# Altium schematic sheet YK.SchDoc
size A3
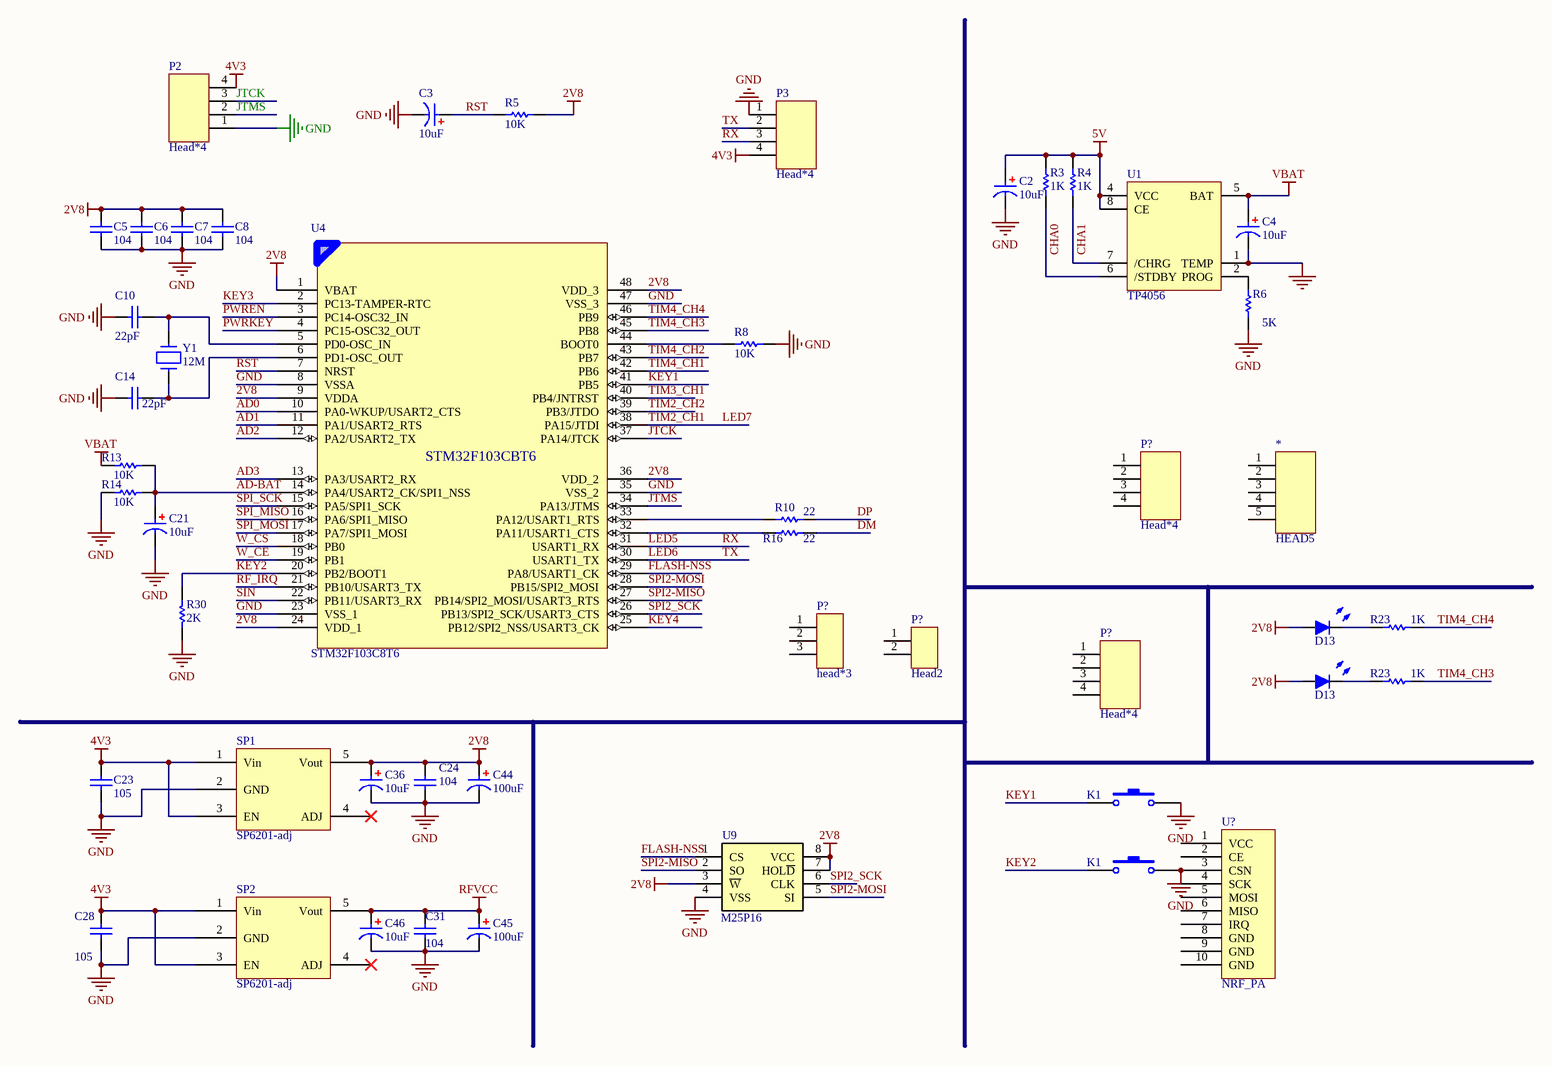
[diagram p0: YK.SchDoc]

## Parts
(Parts that share a designator on the sheet are numbered #1, #2 ... from top to bottom, then left to right.)
*  HEAD5
C2  C10uF  [0805-INC]  (value not drawn)
C3  C10uF  [0805-INC]  (value not drawn)
C4  C10uF  [0805-INC]  (value not drawn)
C5  C0.1uF  [0603C]  (value not drawn)
C6  C0.1uF  [0603C]  (value not drawn)
C7  C0.1uF  [0603C]  (value not drawn)
C8  C0.1uF  [0603C]  (value not drawn)
C10  C22pF  [0603R]  (value not drawn)
C14  C22pF  [0603R]  (value not drawn)
C21  C10uF  [0805-INC]  (value not drawn)
C23  C1uF  [0603C]  (value not drawn)
C24  C0.1uF  [0603C]  (value not drawn)
C28  C1uF  [0603C]  (value not drawn)
C31  C0.1uF  [0603C]  (value not drawn)
C36  C10uF  [0805-INC]  (value not drawn)
C44  C100uF  [CAP-T-3630]  (value not drawn)
C45  C100uF  [CAP-T-3630]  (value not drawn)
C46  C10uF  [0805-INC]  (value not drawn)
D13#1  LED  [LED]  (value not drawn)
D13#2  LED  [LED]  (value not drawn)
K1#1  KEY-PB  [SW-DIP]  (value not drawn)
K1#2  KEY-PB  [SW-DIP]  (value not drawn)
P2  Head*4  [NIUB-4P]
P3  Head*4  [NIUB-4P]
P?#1  Head*4  [HEAD*4]
P?#2  head*3  [head*3 - duplicate]
P?#3  Head2  [HEAD2]
P?#4  Head*4  [HEAD*4]
R3  R1K  [0603R]  (value not drawn)
R4  R1K  [0603R]  (value not drawn)
R5  R10K  [0603R]  (value not drawn)
R6  5K  [0603R]
R8  R10K  [0603R]  (value not drawn)
R10  R22  [0603R]  (value not drawn)
R13  R10K  [0603R]  (value not drawn)
R14  R10K  [0603R]  (value not drawn)
R16  R22  [0603R]  (value not drawn)
R23#1  R1K  [0603R]  (value not drawn)
R23#2  R1K  [0603R]  (value not drawn)
R30  R2K  [0603R]  (value not drawn)
SP1  SP6201-adj  [SOT23-5]
SP2  SP6201-adj  [SOT23-5]
U1  TP4056  [SOP-8]
U4  STM32F103C8T6  [STM32C8T6]
U9  M25P16  [SO8-big]
U?  NRF_PA
Y1  12M  [XTAL3225]

## Nets
2V8: C5.2 C6.2 C7.2 C8.2 C24.2 C36.1 C44.1 D13#1.1(A) D13#2.1(A) R5.2 SP1.5(Vout) U4.1(VBAT) U4.9(VDDA) U4.24(VDD_1) U4.36(VDD_2) U4.48(VDD_3) U9.3(~{W}) U9.7(HOL~{D}) U9.8(VCC)
4V3: C23.2 C28.2 P2.4 P3.4 SP1.1(Vin) SP1.3(EN) SP2.1(Vin) SP2.3(EN)
5V: C2.1 R3.2 R4.2 U1.4(VCC) U1.8(CE)
GND: C2.2 C3.2 C4.2 C5.1 C6.1 C7.1 C8.1 C10.1 C14.1 C21.2 C23.1 C24.1 C28.1 C31.1 C36.2 C44.2 C45.2 C46.2 K1#1.2 K1#2.2 P2.1 P3.1 R6.1 R8.2 R14.1 R30.1 SP1.2(GND) SP2.2(GND) U1.1(TEMP) U1.3(GND) U4.8(VSSA) U4.23(VSS_1) U4.35(VSS_2) U4.47(VSS_3) U9.4(VSS) U?.3(CSN)
RFVCC: C31.2 C45.1 C46.1 SP2.5(Vout)
VBAT: C4.1 R13.1 U1.5(BAT)
AD0: U4.10(PA0-WKUP/USART2_CTS)
AD1: U4.11(PA1/USART2_RTS)
AD2: U4.12(PA2/USART2_TX)
AD3: U4.13(PA3/USART2_RX)
AD-BAT: C21.1 R13.2 R14.2 U4.14(PA4/USART2_CK/SPI1_NSS)
CHA0: R3.1 U1.6(/STDBY)
CHA1: R4.1 U1.7(/CHRG)
DM: R16.1
DP: R10.1
FLASH-NSS: U4.29(PA8/USART1_CK) U9.1(CS)
JTCK: P2.3 U4.37(PA14/JTCK)
JTMS: P2.2 U4.34(PA13/JTMS)
KEY1: K1#1.1 U4.41(PB5)
KEY2: K1#2.1 R30.2 U4.20(PB2/BOOT1)
KEY3: U4.2(PC13-TAMPER-RTC)
KEY4: U4.25(PB12/SPI2_NSS/USART3_CK)
LED5: P3.3 U4.31(USART1_RX)  [also labelled RX]
LED6: P3.2 U4.30(USART1_TX)  [also labelled TX]
LED7: U4.38(PA15/JTDI)  [also labelled TIM2_CH1]
PWREN: U4.3(PC14-OSC32_IN)
PWRKEY: U4.4(PC15-OSC32_OUT)
RF_IRQ: U4.21(PB10/USART3_TX)
RST: C3.1 R5.1 U4.7(NRST)
SIN: U4.22(PB11/USART3_RX)
SPI2-MISO: U4.27(PB14/SPI2_MOSI/USART3_RTS) U9.2(SO)
SPI2-MOSI: U4.28(PB15/SPI2_MOSI) U9.5(SI)
SPI2_SCK: U4.26(PB13/SPI2_SCK/USART3_CTS) U9.6(CLK)
SPI_MISO: U4.16(PA6/SPI1_MISO)
SPI_MOSI: U4.17(PA7/SPI1_MOSI)
SPI_SCK: U4.15(PA5/SPI1_SCK)
TIM2_CH2: U4.39(PB3/JTDO)
TIM3_CH1: U4.40(PB4/JNTRST)
TIM4_CH1: U4.42(PB6)
TIM4_CH2: U4.43(PB7)
TIM4_CH3: R23#2.2 U4.45(PB8)
TIM4_CH4: R23#1.2 U4.46(PB9)
W_CE: U4.19(PB1)
W_CS: U4.18(PB0)
NetC10_2: C10.2 U4.5(PD0-OSC_IN) Y1.3
NetC14_2: C14.2 U4.6(PD1-OSC_OUT) Y1.1
NetD13#1_2: D13#1.2(K) R23#1.1
NetD13#2_2: D13#2.2(K) R23#2.1
NetR6_2: R6.2 U1.2(PROG)
NetR8_1: R8.1 U4.44(BOOT0)
NetR10_2: R10.2 U4.33(PA12/USART1_RTS)
NetR16_2: R16.2 U4.32(PA11/USART1_CTS)

Not connected (* = marked no-connect by the designer): * 1 2 3 4 5; P?#1 1 2 3 4; P?#2 1 2 3; P?#3 1 2; P?#4 1 2 3 4; SP1 4(ADJ)*; SP2 4(ADJ)*; U? 1(VCC) 2(CE) 4(SCK) 5(MOSI) 6(MISO) 7(IRQ) 8(GND) 9(GND) 10(GND)

## Notes on the sheet
- (in symbol C0.1uF) 105; 104
- (in symbol C10uF) 10uF
- (in symbol C22pF) 22pF
- (in symbol C100uF) 100uF
- (in symbol R1K) 1K
- (in symbol R10K) 10K; 22; 2K
- (in symbol R100K) 10K
- (in symbol STM32F103C8T6) STM32F103CBT6

## Library data of the parts
C23 C28 = C0.1uF
R6 = R5K
R10 R16 R30 = R10K
R13 R14 = R100K
SP1 SP2 = SP6201
U9 = M25PE16
Y1 = CRYSTAL